# Altium schematic sheet Principal_v1.SchDoc
size A2; SheetNumber: 1; SheetTotal: 1
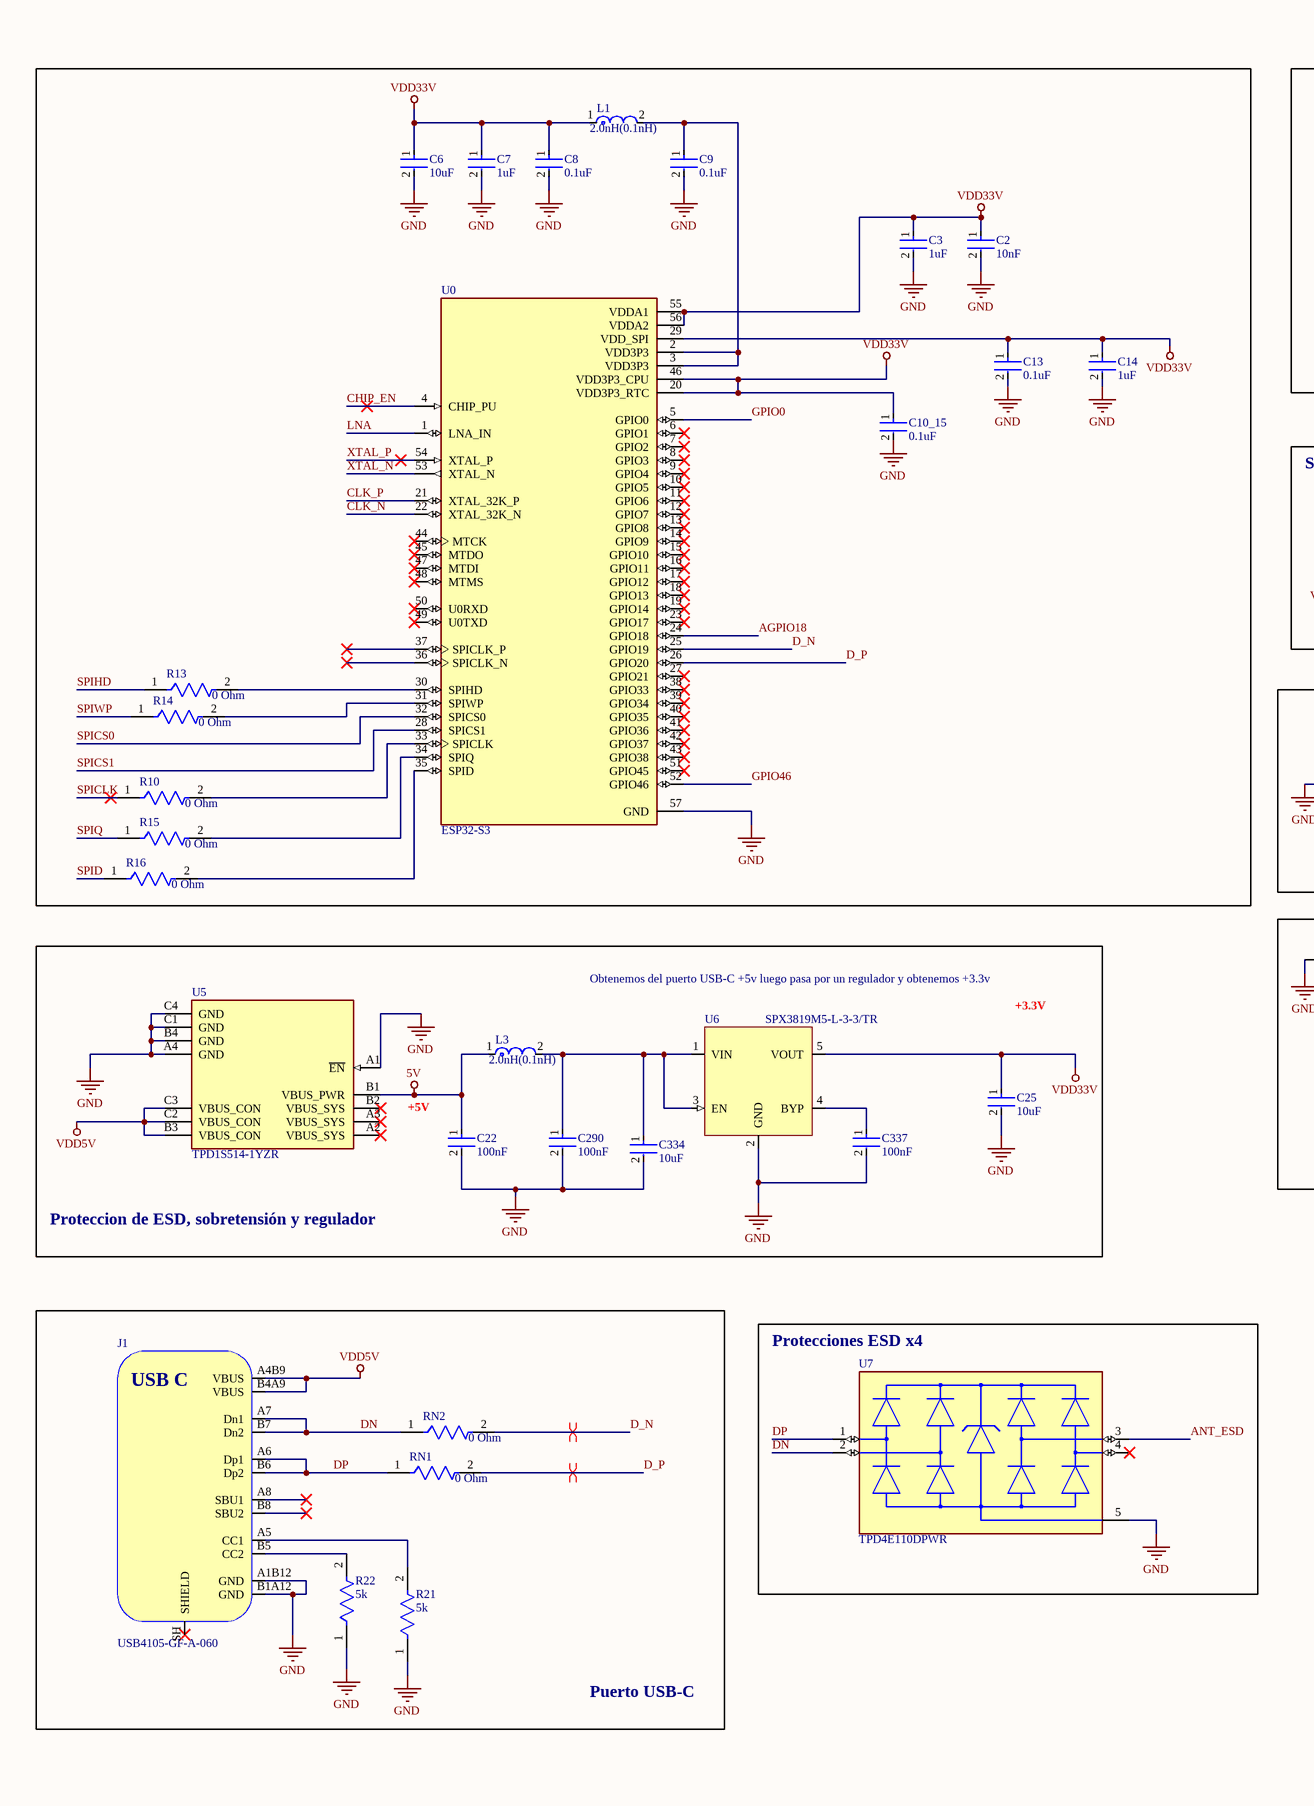
[diagram p0: Principal_v1.SchDoc, left]
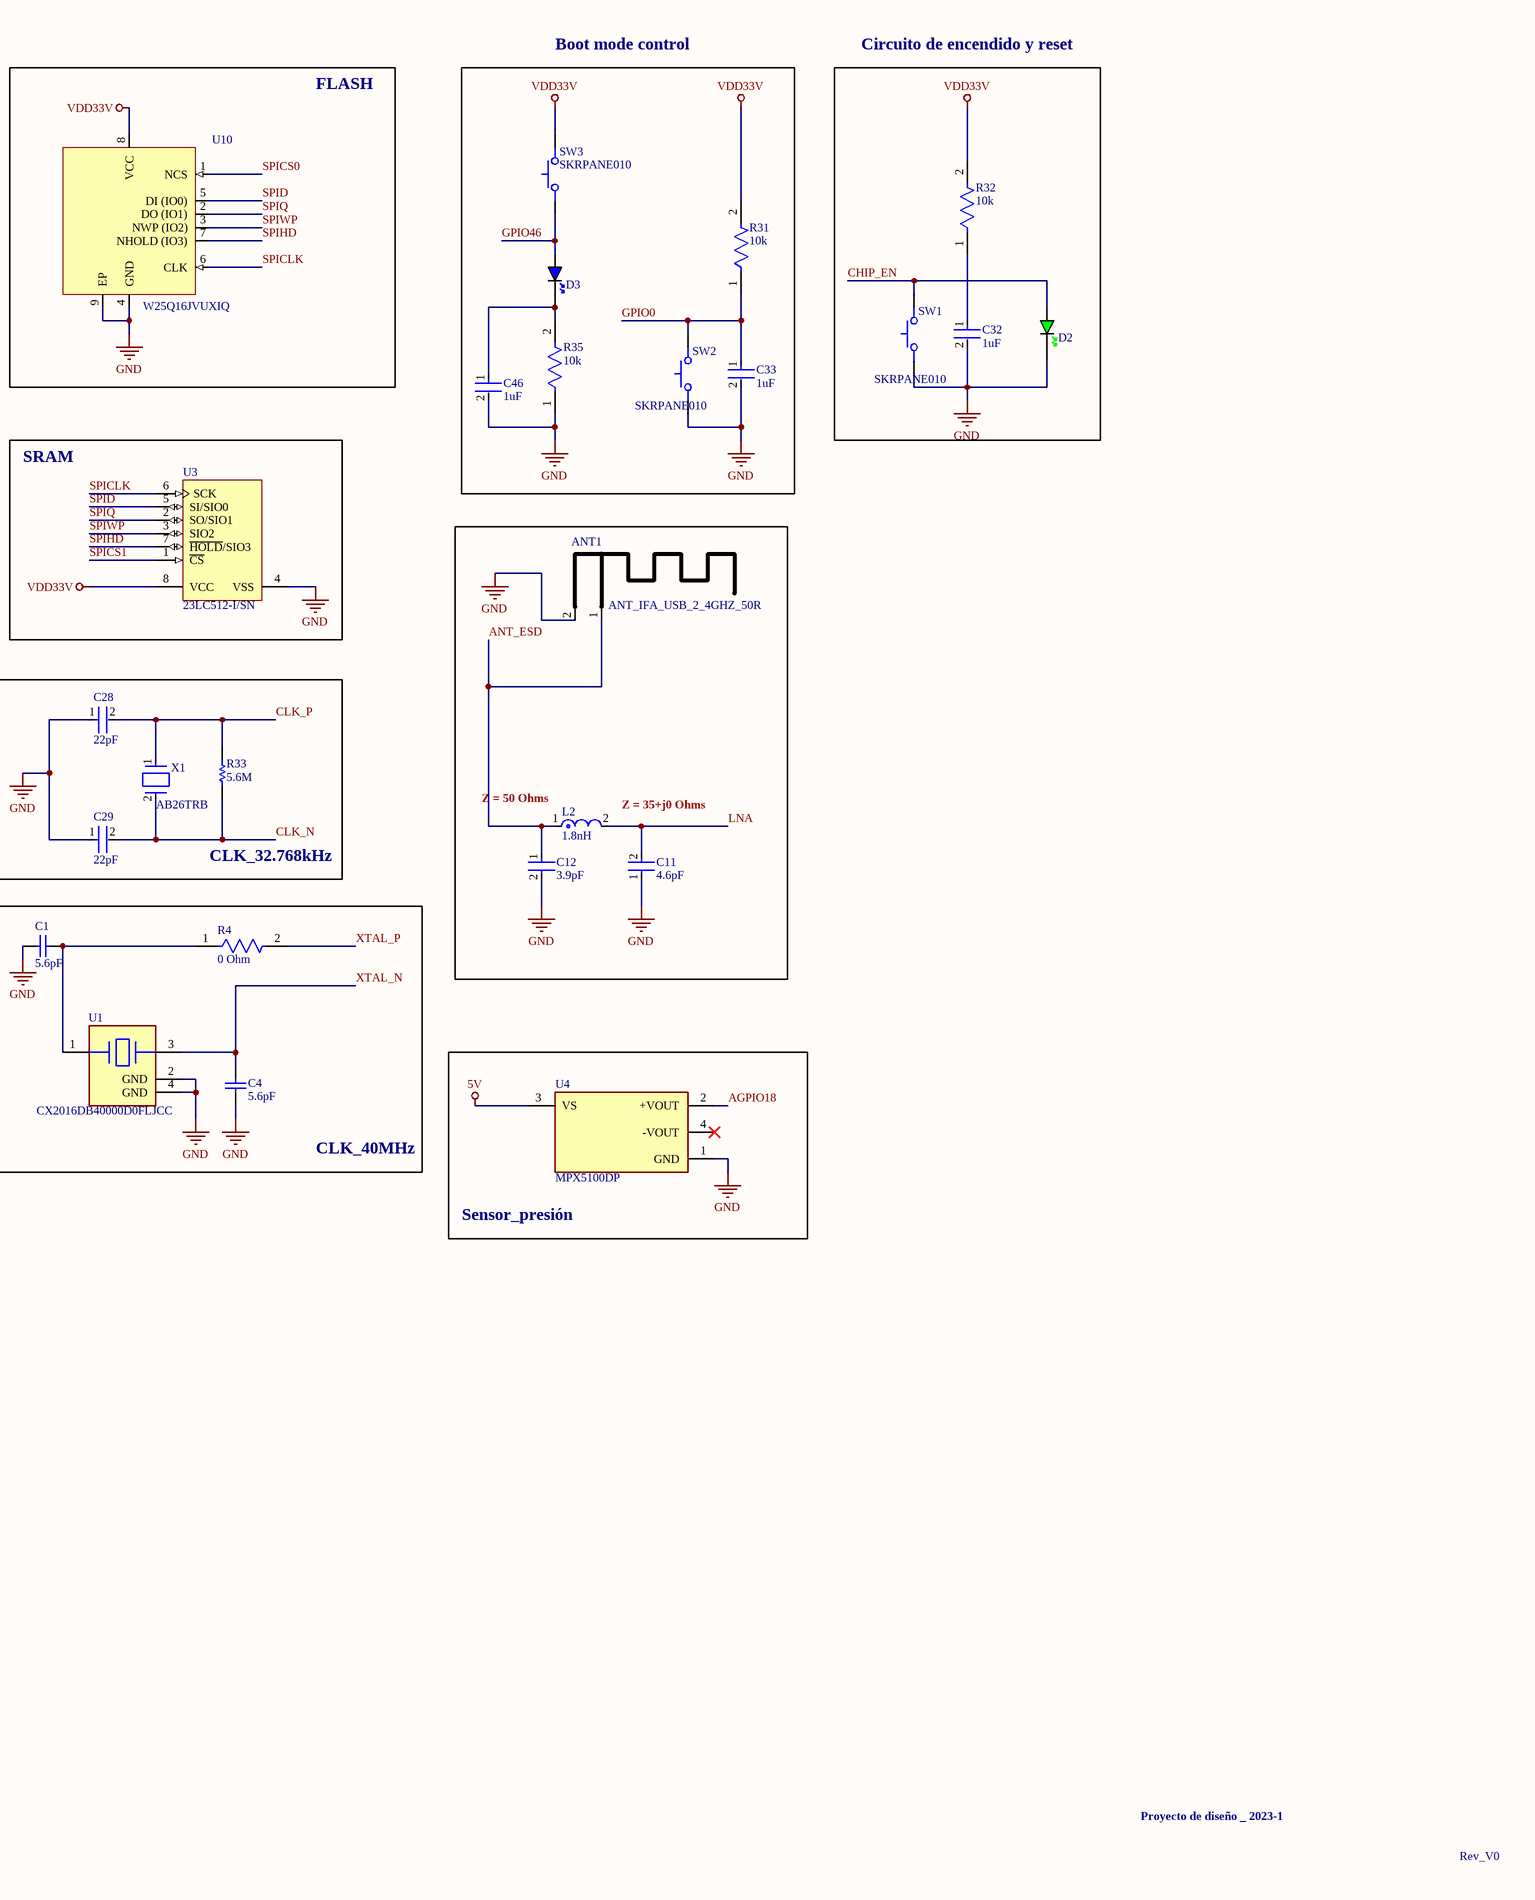
[diagram p1: Principal_v1.SchDoc, right]

## Parts
ANT1  ANT_IFA_USB_2_4GHZ_50R  [ANT_IFA_USB_2_4GHZ_50R]  (no BOM)
C1  5.6pF  [CAPC1006X50X20LL10T10]
C2  10nF  [FP-GRM033-0_03-IPC_B]
C3  1uF  [FP-C0402C105K9PACTU-MFG]
C4  5.6pF  [CAPC1006X50X20LL10T10]
C6  10uF  [FP-GRM155-0_2-IPC_C]
C7  1uF  [FP-C0402C105K9PACTU-MFG]
C8  0.1uF  [FP-CL278-IPC_C]
C9  0.1uF  [FP-CL278-IPC_C]
C10_15  0.1uF  [FP-CL278-IPC_C]
C11  4.6pF  [FP-CBR04C-MFG]
C12  3.9pF  [FP-GRM033-0_03-IPC_B]
C13  0.1uF  [FP-CL278-IPC_C]
C14  1uF  [FP-C0402C105K9PACTU-MFG]
C22  100nF  [FP-CL278-IPC_C]
C25  10uF  [FP-GRM155-0_2-IPC_C]
C28  22pF  [FP-C0603C-CF-MFG]
C29  22pF  [FP-C0603C-CF-MFG]
C32  1uF  [FP-C0402C105K9PACTU-MFG]
C33  1uF  [FP-C0402C105K9PACTU-MFG]
C46  1uF  [FP-C0402C105K9PACTU-MFG]
C290  100nF  [FP-CL278-IPC_C]
C334  10uF  [FP-GRM155-0_2-IPC_C]
C337  100nF  [FP-CL278-IPC_C]
D2  GREEN  [LED_0603_GREEN]  (value not drawn)
D3  BLUE  [LED_0603_BLUE]  (value not drawn)
J1  USB4105-GF-A-060  [USB4105-GF-A-060]
L1  2.0nH(0.1nH)  [FP-LQG15HH_02-MFG]
L2  1.8nH  [FP-LQP03TG_02-IPC_B]
L3  2.0nH(0.1nH)  [FP-LQG15HH_02-MFG]
R4  0 Ohm  [FP-RMCF0402-MFG]
R10  0 Ohm  [FP-RMCF0402-MFG]
R13  0 Ohm  [FP-RMCF0402-MFG]
R14  0 Ohm  [FP-RMCF0402-MFG]
R15  0 Ohm  [FP-RMCF0402-MFG]
R16  0 Ohm  [FP-RMCF0402-MFG]
R21  5k  [FP-PNM0402-IPC_C]
R22  5k  [FP-PNM0402-IPC_C]
R31  10k  [FP-CRGP0603-IPC_C]
R32  10k  [FP-CRGP0603-IPC_C]
R33  5.6M  [RESC1005X40X25ML05T10]
R35  10k  [FP-CRGP0603-IPC_C]
RN1  0 Ohm  [FP-RMCF0402-MFG]
RN2  0 Ohm  [FP-RMCF0402-MFG]
SW1  SKRPANE010  [SKRPANE010]
SW2  SKRPANE010  [SKRPANE010]
SW3  SKRPANE010  [SKRPANE010]
U0  ESP32-S3  [IC_ESP32-S3]
U1  CX2016DB40000D0FLJCC  [FP-CX2016DB-MFG]
U3  23LC512-I/SN  [MCHP-SOIC-SN8_N]
U4  MPX5100DP  [FP-SOT1754-1-MFG]
U5  TPD1S514-1YZR  [BGA12N40P3X4_140X189X62N]
U6  SPX3819M5-L-3-3/TR  [SOT-23-5]
U7  TPD4E110DPWR  [FP-DPW0004A-MFG]
U10  W25Q16JVUXIQ  [USON-8-2X3MM]
X1  AB26TRB  [FP-AB26TRB-MFG]

## Blocks framed on the sheet
FLASH: U10
Boot mode control: C33 C46 D3 R31 R35 SW2 SW3
Circuito de encendido y reset: C32 D2 R32 SW1
SRAM: U3
CLK_32.768kHz: C28 C29 R33 X1
CLK_40MHz: C1 C4 R4 U1
Proteccion de ESD, sobretensión y regulador: C22 C25 C290 C334 C337 L3 U5 U6
Sensor_presión: U4
Puerto USB-C: J1 R21 R22 RN1 RN2
Protecciones ESD x4: U7

## Nets
5V: C22.1 L3.1 U4.3(VS) U5.B1(VBUS_PWR)
GND: ANT1.2(GND) C1.1 C2.2 C3.2 C4.1 C6.2 C7.2 C8.2 C9.2 C10_15.2 C11.1 C12.2 C13.2 C14.2 C22.2 C25.2 C28.1 C29.1 C32.2 C33.2 C46.2 C290.2 C334.2 C337.2 D2.K J1.A1B12(GND) J1.B1A12(GND) R21.1 R22.1 R35.1 SW1.12 SW2.12 U0.57(GND) U1.2(GND) U1.4(GND) U3.4(VSS) U4.1(GND) U5.A1(~{EN}) U5.A4(GND) U5.B4(GND) U5.C1(GND) U5.C4(GND) U6.2(GND) U7.5(GND) U10.4(GND) U10.9(EP)
VDD5V: J1.A4B9(VBUS) J1.B4A9(VBUS) U5.B3(VBUS_CON) U5.C2(VBUS_CON) U5.C3(VBUS_CON)
VDD33V: C2.1 C3.1 C6.1 C7.1 C8.1 C10_15.1 C13.1 C14.1 C25.1 L1.1 R31.2 R32.2 SW3.34 U0.20(VDD3P3_RTC) U0.29(VDD_SPI) U0.46(VDD3P3_CPU) U0.55(VDDA1) U0.56(VDDA2) U3.8(VCC) U6.5(VOUT) U10.8(VCC)
AGPIO18: U0.24(GPIO18) U4.2(+VOUT)
ANT_ESD: ANT1.1(RF) C12.1 L2.1 U7.3(IO3)
CHIP_EN: D2.A SW1.34 U0.4(CHIP_PU)
CLK_N: C29.2 R33.1 U0.22(XTAL_32K_N) X1.2
CLK_P: C28.2 R33.2 U0.21(XTAL_32K_P) X1.1
D_N: RN2.2 U0.25(GPIO19)
D_P: RN1.2 U0.26(GPIO20)
DN: J1.A7(Dn1) J1.B7(Dn2) RN2.1 U7.2(IO2)
DP: J1.A6(Dp1) J1.B6(Dp2) RN1.1 U7.1(IO1)
GPIO0: C33.1 R31.1 SW2.34 U0.5(GPIO0)
GPIO46: D3.A SW3.12 U0.52(GPIO46)
LNA: C11.2 L2.2 U0.1(LNA_IN)
SPICLK: R10.1 U3.6(SCK) U10.6(CLK)
SPICS0: U0.32(SPICS0) U10.1(NCS)
SPICS1: U0.28(SPICS1) U3.1(~{CS})
SPID: R16.1 U3.5(SI/SIO0) U10.5(DI_(IO0))
SPIHD: R13.1 U3.7(~{HOLD}/SIO3) U10.7(NHOLD_(IO3))
SPIQ: R15.1 U3.2(SO/SIO1) U10.2(DO_(IO1))
SPIWP: R14.1 U3.3(SIO2) U10.3(NWP_(IO2))
XTAL_N: C4.2 U0.53(XTAL_N) U1.3
XTAL_P: R4.2 U0.54(XTAL_P)
NetC1_2: C1.2 R4.1 U1.1
NetC9_1: C9.1 L1.2 U0.2(VDD3P3) U0.3(VDD3P3)
NetC32_1: C32.1 R32.1
NetC46_1: C46.1 D3.K R35.2
NetC290_1: C290.1 C334.1 L3.2 U6.1(VIN) U6.3(EN)
NetC337_1: C337.1 U6.4(BYP)
NetJ1_A5: J1.A5(CC1) R21.2
NetJ1_B5: J1.B5(CC2) R22.2
NetR10_2: R10.2 U0.33(SPICLK)
NetR13_2: R13.2 U0.30(SPIHD)
NetR14_2: R14.2 U0.31(SPIWP)
NetR15_2: R15.2 U0.34(SPIQ)
NetR16_2: R16.2 U0.35(SPID)

Not connected (* = marked no-connect by the designer): J1 A8(SBU1)* B8(SBU2)* SH(SHIELD)*; U0 6(GPIO1)* 7(GPIO2)* 8(GPIO3)* 9(GPIO4)* 10(GPIO5)* 11(GPIO6)* 12(GPIO7)* 13(GPIO8)* 14(GPIO9)* 15(GPIO10)* 16(GPIO11)* 17(GPIO12)* 18(GPIO13)* 19(GPIO14)* 23(GPIO17)* 27(GPIO21)* 36(SPICLK_N)* 37(SPICLK_P)* 38(GPIO33)* 39(GPIO34)* 40(GPIO35)* 41(GPIO36)* 42(GPIO37)* 43(GPIO38)* 44(MTCK)* 45(MTDO)* 47(MTDI)* 48(MTMS)* 49(U0TXD)* 50(U0RXD)* 51(GPIO45)*; U4 4(-VOUT)*; U5 A2(VBUS_SYS)* A3(VBUS_SYS)* B2(VBUS_SYS)*; U7 4(IO4)*

## Layout directives
differential pair: D_N, D_P

## Notes on the sheet
- (near L2) Z = 50 Ohms
- (near L2) Z = 35+j0 Ohms
- Obtenemos del puerto USB-C +5v luego pasa por un regulador y obtenemos +3.3v
- +3.3V
- +5V
- Proyecto de diseño _ 2023-1
- Rev_V0
- (in symbol CMP-002-00129-1) USB C

## Library data of the parts
ANT1 = CMP-027-000136-1: Inverted F 2.4GHz ISM PCB Antenna 50 Ohm; Source: Schematic-Lib-PhilsLab.SchLib; Design Item ID: ANT_IFA_USB_2_4GHZ_50R; ComponentLink1URL: https://www.ti.com/lit/an/swra117d/swra117d.pdf; ComponentLink1Description: Datasheet
C1 C4 = CMP-2008-04814-1: Manufacturer: AVX Interconnect / Elco; Part Number: 04023J5R6BBSTR
C2 = CMP-2010-01684-2: Chip Multilayer Ceramic Capacitors for General Purpose, 0201, 10000pF, X7R, 15%, 10%, 10V; Package Quantity: 1; Width: 0.012inch; Voltage: 10V; Mount: Surface Mount; Capacitance: 10nF; Voltage Rating (DC): 10V; Voltage Rating: 10V; Length: 0.6mm; Packaging: Tape and Reel; Material: Ceramic; Dielectric: X7R; REACH SVHC: No SVHC; Termination: SMD/SMT; Case/Package: 0201; Radiation Hardening: No; Height: 0.3mm; Tolerance: 10%; Case Code (Imperial): 0201; Min Operating Temperature: -55°C; Lead Free: Lead Free; Thickness: 0.013inch; Depth: 0.3mm; Case Code (Metric): 0603; Max Operating Temperature: 125°C
C3 C7 C14 C32 C33 C46 = CMP-2008-02075-2: CAP CER 1UF 6.3V X5R 0402; Tolerance: 10%; Dielectric Material: Ceramic; Series: C; Lead Free: Lead Free; Min Operating Temperature: -55°C; Capacitance: 1uF; Voltage Rating (DC): 6.3V; Number of Pins: 2; REACH SVHC: No SVHC; Mount: Surface Mount; Lead Pitch: 0.3mm; Case Code (Imperial): 0402; RoHS Compliant: Yes; Radiation Hardening: No; Construction: Flat; Depth: 0.5mm; Case/Package: 0402; Termination: SMD/SMT; Height: 0.5mm; Thickness: 0.022inch; Voltage: 6.3V; Dielectric: X5R; Width: 0.02inch; Voltage Rating: 6.3V; Max Operating Temperature: 85°C; Packaging: Tape and Reel; Package Quantity: 1; Length: 1mm
C6 C25 C334 = CMP-06035-044652-1: Chip Multilayer Ceramic Capacitors for General Purpose, 0402, 10uF, X5R, 15%, 20%, 6.3V
C8 C9 C10_15 C13 C22 C290 C337 = CMP-13271-000728-1: Cap Ceramic 100nF 25V X5R ±10% SMD 0402 +85°C Paper T/R; Package Quantity: 1; Height: 0.5mm; Case Code (Metric): 1005; Thickness: 0.022inch; Mount: Surface Mount; Lead Free: Lead Free; Case Code (Imperial): 0402; Packaging: Tape and Reel; Depth: 0.5mm; Voltage: 25V; Min Operating Temperature: -55°C; Voltage Rating: 25V; Dielectric: X5R; Case/Package: 0402; Tolerance: 10%; Width: 0.02inch; Max Operating Temperature: 85°C; Capacitance: 100nF; Length: 1mm; Radiation Hardening: No; Voltage Rating (DC): 25V
C11 = CMP-03020-033502-1: CBR0402 4.6 pF 30ppm/°C 0.1 pF C0G 50 V; Manufacturer Part Number: CBR04C469B5GAC; Manufacturer: KEMET; Tolerance: 0.1 pF; Voltage Rating: 50 V; Material: Ceramic; Device Class L1: Passive Components; Package: CBR04C; Value: 4.6 pF; ComponentLink2Description: Datasheet; Automotive: No; Device Class L2: Capacitors; Device Class L3: Ceramic Capacitors; Temperature: -55°C to +125°C; Category: Cap; Temperature Coefficient: 30ppm/°C; Lead Free: Yes; Temperature Characteristic: C0G; Mouser Description: Cap Ceramic 4.6pF 50V C0G 0.1pF SMD 0402 125°C Paper T/R; Capacitance: 4.6 pF; Ipc Land Pattern Name: CAPC10050X50; Height: 0.55mm; RoHS: TRUE; ComponentLink2URL: https://content.kemet.com/datasheets/KEM_C1030_CBR_SMD.pdf; Octopart: https://octopart.com/cbr04c469b5gac-kemet-86730458; Temperature Range High: +125°C; Temperature Range Low: -55°C
C12 = CMP-2010-01120-2: Chip Multilayer Ceramic Capacitors for General Purpose, 0201, 3.9pF, C0G, 30ppm/°C, 0.25pF, 50V; Width: 0.012inch; Thickness: 0.013inch; Length: 0.024inch; Voltage Rating (DC): 50V; Case/Package: 0201; Termination: SMD/SMT; Min Operating Temperature: -55°C; Voltage Rating: 50V; Packaging: Tape and Reel; Max Operating Temperature: 125°C; Capacitance: 3.9pF; Mount: Surface Mount; Package Quantity: 15000
C28 C29 = CMP-2006-03119-3: Cap Ceramic 22pF 50V C0G 5% SMD 0603 125°C Paper T/R; Manufacturer Part Number: C0603C220J5GACTU; Manufacturer: KEMET; Temperature Coefficient: 30ppm/°C; Automotive Grade: Grade 1; Tolerance: 0.05; RoHS: TRUE; Temperature Characteristic: C0G; Capacitance: 22 pF; Device Class L3: Ceramic Capacitors; Digikey Description: Cap Ceramic 22pF 50V C0G 5% SMD 0603 125°C Paper T/R; ComponentLink2URL: https://api.kemet.com/component-edge/download/datasheet/C0603C100J5GACAUTO.pdf; ComponentLink2Description: Datasheet; Automotive: Yes; Temperature: -55°C to +125°C; Temperature Range High: +125°C; Package: C0603C-CF; Device Class L1: Passive Components; Device Class L2: Capacitors; Lead Free: Yes; Value: 22 pF; Category: Cap; Mouser Description: Cap Ceramic 22pF 50V C0G 5% SMD 0603 125°C Paper T/R; Voltage Rating: 50 V; Height: 0.87mm; Material: Ceramic; Temperature Range Low: -55°C; Octopart: https://octopart.com/c0603c220j5gactu-kemet-98525
D2 = LED_0603_GREEN: LED 0603 GREEN SMD; Supplier 1: Arrow Electronics; Supplier Part Number 1: LTST-C190GKT
D3 = LED_0603_BLUE: LED 0603 BLUE SMD; Supplier 1: Arrow Electronics; Supplier Part Number 1: LTST-C191TBKT
J1 = CMP-002-00129-1: USB Connector Type C SMT 12 Pin; Manufacturer: GCT; Distributor Link: https://eu.mouser.com/ProductDetail/GCT/USB4105-GF-A-060?qs=QNEnbhJQKvY2mocwNJzgfA%3D%3D; Manufacturer Part Number: USB4105-GF-A-060; Source: Schematic-Lib-PhilsLab.SchLib; Design Item ID: USB4105-GF-A-060
L1 L3 = CMP-06042-013960-1: Multilayer type RF Inductor 2nH ±0.1nH 0.09Ω 900mA 0402
L2 = CMP-06042-011516-1: Film type RF Inductor 1.8nH ±0.1nH 600mA 0.15Ω 0201 (0603); Self Resonant Frequency: 6GHz; Current: 450mA; Q Factor: 14; Test Frequency: 500MHz; Shielding: Unshielded; DC Resistance (DCR): 150mR; Core Material: Non-Magnetic; Termination: SMD/SMT; Height - Seated (Max): 0.013inch; Package Quantity: 15000; Case/Package: 0201; Depth: 0.33mm; REACH SVHC: No SVHC; Length: 0.024inch; Case Code (Imperial): 0201; DC Current: 600mA; Packaging: Tape and Reel; Current Rating: 600mA; Radiation Hardening: No; Inductance: 1.8nH; Resistor Type: Thin Film; Mount: Surface Mount; Max Operating Temperature: 125°C; Height: 0.012inch; Case Code (Metric): 0603; Military Standard: Not; Min Operating Temperature: -55°C; Width: 0.012inch; Max DC Current: 600mA
R4 R10 R13-R16 RN1 RN2 = CMP-26527-007617-1: RES 0 OHM JUMPER 1/16W 0402; Power Rating: 63mW; Working Voltage: 50V; Current Rating: 1A; Resistance: 0R; Series: RMCF; RoHS Compliant: Yes; Features: Automotive AEC-Q200; Width: 0.02inch; Depth: 0.5mm; Resistor Type: Thick Film; Number of Terminations: 2; Radiation Hardening: No; Length: 0.039inch; Contact Plating: Tin; Case/Package: 0402; Min Operating Temperature: -55°C; Case Code (Metric): 1005; Construction: Rectangular; Mount: Surface Mount; Max Operating Temperature: 155°C; Max Power Dissipation: 63mW; Height: 0.016inch; Lead Free: Lead Free; Packaging: Tape and Reel; Technology: THICK FILM; Case Code (Imperial): 0402; Military Standard: Not
R21 R22 = CMP-02407-012302-1: RES SMD 5K OHM 0.1% 1/20W 0402; Temperature Coefficient: 25ppm/°C; Resistance: 5kR; Max Power Dissipation: 50mW; Width: 0.022inch; Height: 0.033inch; Tolerance: 0.1%; Number of Terminations: 2; Packaging: Tape and Reel; RoHS Compliant: Yes; Case Code (Imperial): 0402; Min Operating Temperature: -55°C; Case Code (Metric): 1005; Features: Moisture Resistant; Max Operating Temperature: 155°C; Package Quantity: 1000; Resistor Type: Thin Film; Length: 0.042inch; Case/Package: 0402
R31 R32 R35 = CMP-03211-004414-1: CRGP 0603 10K 1%; Manufacturer Part Number: CRGP0603F10K; Manufacturer: TE; Voltage Rating: 50V; Power Rating: 0.25W; Value: 10KΩ; Tolerance: 0.01; Temperature Coefficient: ±100ppm/°C; Octopart: https://octopart.com/crgp0603f10k-te+connectivity-91018721; Temperature Range Low: -55°C; Temperature Range High: +155°C; Device Class L3: Chip SMD Resistors; Package: CRGP0603; Height: 0.55mm; Series: CRGP; RoHS: TRUE; Composition: Thick Film; Digikey Description: CRGP 0603 10K 1%; Ipc Land Pattern Name: RESC16080X45; Mouser Description: Res, 10K, 1%, 0.25W, 0603, Thick Film; ComponentLink2Description: Datasheet; ComponentLink2URL: https://www.te.com/commerce/DocumentDelivery/DDEController?Action=srchrtrv&DocNm=9-1773463-9&DocType=DS&DocLang=English; Temperature: -55°C to +155°C; Device Class L1: Passive Components; Lead Free: Yes; Ambient Temperature Range High: +70°C; Device Class L2: Resistors; Automotive: No; Category: Res; Resistance: 10KΩ
R33 = CMP-2002-07139-1: Manufacturer: Yageo / Phycomp; Part Number: RC0402JR-075M6L
SW1-SW3 = SKRPANE010: Tactile Switch SMD SPST; Manufacturer: Alps Alpine; Manufacturer Part Number: SKRPANE010
  SW1: Supplier 1: Mouser; Supplier Part Number 1: 688-SKRPANE010
U0 = CMP-031-00008-2: IC RF TxRx + MCU Bluetooth, WiFi 802.11b/g/n, Bluetooth v5.0 2.412GHz ~ 2.484GHz 56-VFQFN Exposed Pad; MF: Espressif Systems; Availability: In Stock; Value: *; Pins: 57; Price: None; Purchase-URL: https://pricing.snapeda.com/search/part/ESP32-S3/?ref=eda; Component Type: Standard; Case/Package: None; Check_prices: https://www.snapeda.com/parts/ESP32-S3/Espressif+Systems/view-part/?ref=eda; Design Item ID: ESP32-S3; MP: ESP32-S3; Source: ESP32-S3.SchLib; SnapEDA_Link: https://www.snapeda.com/parts/ESP32-S3/Espressif+Systems/view-part/?ref=snap
U1 = CMP-20727-000002-1: CRYSTAL 40.0000MHZ 8PF SMD; Manufacturer: Kyocera International Inc. Electronic Components; Esr: 50Ω; Tolerance: 15ppm; Frequency: 40MHz; Series: CX2016DB; RoHS: TRUE; Temperature Range High: +85°C; Height: 0.45mm; Manufacturer Part Number: CX2016DB40000D0FLJCC; ComponentLink2Description: Datasheet; Load Capacitance: 8pF; ComponentLink2URL: https://global.kyocera.com/prdct/electro/product/pdf/cx2016db_e.pdf; Temperature: -30°C to +85°C; Device Class L2: Crystals / Oscillators; Category: Crys; Mouser Description: Crystal 40MHz 8pF 4-Pin SMD T/R; Lead Free: Yes; Device Class L3: Crystals; Temperature Range Low: -30°C; Octopart: https://octopart.com/cx2016db40000d0fljcc-avx+%2F+kyocera-71139660; Device Class L1: Passive Components; Automotive: No; Digikey Description: CRYSTAL 40.0000MHZ 8PF SMD; Package: CX2016DB; Stability: 15ppm
U3 = CMP-0163-00041-1: 512K bits SPI Serial SRAM with SDI and SQI Interface, 2.5 to 5.5 V, 20 MHz, -40 to 85 degC, 8-pin SOIC (SN8), Tube; Manufacturer: Microchip; ComponentLink1Description: Manufacturer URL; DatasheetVersion: Rev. A; ComponentLink3Description: Package Specification; ComponentLink2URL: http://ww1.microchip.com/downloads/en/DeviceDoc/25155A.pdf; ComponentLink4Description: Product URL; ComponentLink4URL: http://www.microchip.com/23LC512; PackageReference: SOIC-SN8; PackageVersion: C04-057C; ComponentLink1URL: http://www.microchip.com; ComponentLink2Description: Datasheet; PackageDescription: 8-Lead Plastic Small Outline, 4.9 x 3.9 mm Body, 1.27 mm Pitch; ComponentLink3URL: http://www.microchip.com/stellent/groups/techpub_sg/documents/packagingspec/en012702.pdf; PartNumber: 23LC512-I/SN; Mounting Technology: Surface Mount
U4 = CMP-00561-70301700-1: Pressure Sensor 14.5PSI (100kPa) Differential Male - 0.19 (4.93mm) Tube, Dual 0.2 V ~ 4.7 V 6-SIP Module; Accuracy: 0.4%; Port Style: Barbed; Min Supply Voltage: 3V; Response Time: 1ms; Max Pressure: 25.38PSI; Operating Supply Current: 6mA; Output Type: Wheatstone Bridge; Max Supply Voltage: 6V; Height: 33.09mm; NexarPartId: 70301700; Case/Package: SIP; Weight: 5.057838g; Max Operating Temperature: 125°C; REACH SVHC: No SVHC; Min Operating Temperature: -40°C; Lead Free: Lead Free; Termination: PCB; Nominal Supply Current: 6mA; Packaging: Bulk; Radiation Hardening: No; Mount: Through Hole; RoHS: Compliant; Number of Pins: 4; Pressure Type: Differential; Ambient Temperature Range High: 125°C; Schedule B: 8541500080, 8542390000
U5 = CMP-003-000016-2: Interface Circuit, PBGA12; MF: Texas Instruments; Max Supply Voltage: 5.9V; Min Supply Voltage: 3.5V; Texas_Instruments-Purchase-URL: https://snapeda.com/shop?store=Texas+Instruments&id=382764; Availability: Good; JESD-609 Code: e1; Value: *; Max Operating Temperature: 85°C; Component Type: Standard; Source: TPD1S514-1YZR.SchLib; Package: DSBGA-12 Texas Instruments; MP: TPD1S514-1YZR; Pins: 12; Case/Package: VFBGA; Height - Seated (Max): 0.625mm; Pin Count: 12; SnapEDA_Link: https://www.snapeda.com/parts/TPD1S514-1YZR/Texas%20Instruments/view-part/382764/?ref=snap; Interface IC Type: INTERFACE CIRCUIT; Min Operating Temperature: -40°C; DigiKey-Purchase-URL: https://snapeda.com/shop?store=DigiKey&id=382764; Design Item ID: TPD1S514-1YZR; Length: 1.99mm; RoHS Compliant: Yes; Price: None; Mouser-Purchase-URL: https://snapeda.com/shop?store=Mouser&id=382764
U6 = CMP-027-000125-1: 500mA +3.3V Low-Noise LDO Voltage Regulator; Manufacturer: MaxLinear; Design Item ID: SPX3819M5-L-3-3/TR; Manufacturer Part Number: SPX3819M5-L-3-3/TR; Source: Schematic-Lib-PhilsLab.SchLib
U7 = CMP-04985-000023-1: TVS DIODE 5.5VWM 13VC 4X2SON; Capacitance: 0.55pF; Direction: Unidirectional; Leakage Current: 20nA; Operating Supply Voltage: 5.5V; Peak Pulse Power: 35W; Number of Channels: 4; Peak Pulse Current: 5A; Interface: USB; Min Breakdown Voltage: 6.5V; Clamping Voltage: 13V; Power Line Protection: Yes; Max Operating Temperature: 125°C; Lead Free: Lead Free; Mount: Surface Mount; Radiation Hardening: No; Number of Pins: 4; REACH SVHC: No SVHC; Min Operating Temperature: -40°C; Packaging: Cut Tape; Working Voltage: 5.5V; Number of Unidirectional Channels: 4; Length: 0.85mm; RoHS Compliant: Yes; Depth: 0.85mm; Reverse Standoff Voltage: 5.5V
U10 = CMP-031-00019-1: 16M-BIT SERIAL FLASH MEMORY WITH DUAL/QUAD SPI USON-8; Manufacturer: Winbond; Design Item ID: W25Q16JVUXIQ; LCSC: C2843335; Manufacturer Part Number: W25Q16JVUXIQ; Source: Schematic-Lib-PhilsLab.SchLib
X1 = CMP-27762-006068-1: CRYSTAL 32.7680KHZ 12.5PF TH; Frequency Stability: -0.034ppm; Frequency Tolerance: 20ppm; Frequency: 32.768kHz; Operating Frequency: 32.768 kHz; Series Resistance: 50kR; Case/Package: Radial; Package Quantity: 500; Packaging: Tape and Reel; Lead Pitch: 2.54mm; Termination: Radial; Mount: Surface Mount; Min Operating Temperature: -40°C; REACH SVHC: No SVHC; Load Capacitance: 12.5pF; Lead Free: Lead Free; Max Operating Temperature: 85°C; Length: 6mm; Height: 0.075inch; Depth: 1.9mm; Tolerance: 20ppm; ESR (Equivalent Series Resistance): 50kR; Number of Pins: 2; Series: AB26TRB